# EAGLE schematic LEDdriverSFE_CREE (EAGLE 6.2)
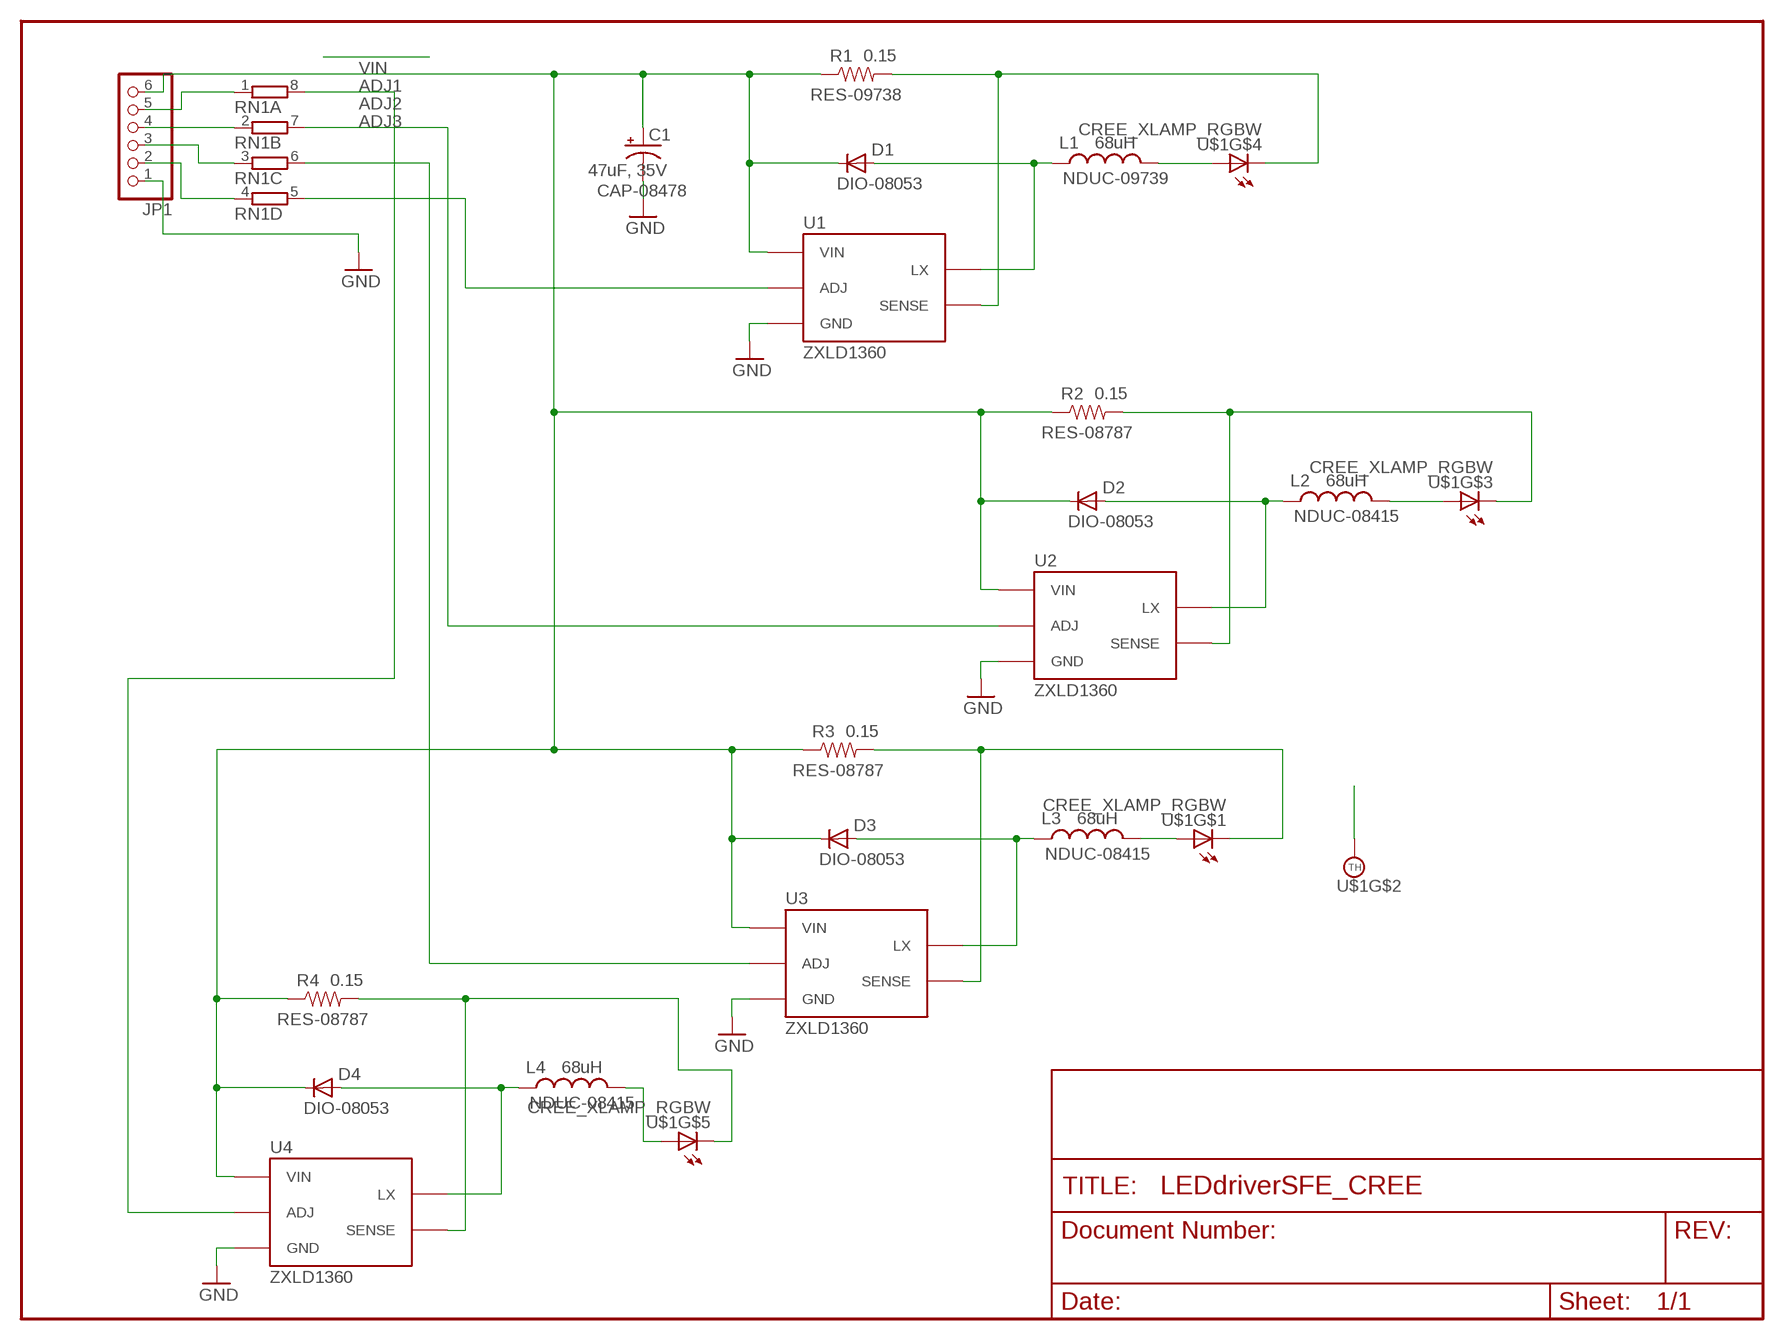
[diagram p0: schematic, sheet 1]

## Parts
C1  47uF, 35V  CAP_POLD  [PANASONIC_D]
D1  MBRA140  DIODESMA  [SMA-DIODE]
D2  MBRA140  DIODESMA  [SMA-DIODE]
D3  MBRA140  DIODESMA  [SMA-DIODE]
D4  MBRA140  DIODESMA  [SMA-DIODE]
JP1  PINHD-1X6  [1X06]
L1  68uH  INDUCTORCR75  [CR75]
L2  68uH  INDUCTORCR75  [CR75]
L3  68uH  INDUCTORCR75  [CR75]
L4  68uH  INDUCTORCR75  [CR75]
R1  0.15  RESISTOR0603-RES  [0603-RES]
R2  0.15  RESISTOR0603-RES  [0603-RES]
R3  0.15  RESISTOR0603-RES  [0603-RES]
R4  0.15  RESISTOR0603-RES  [0603-RES]
RN1  4R-NEXBV8V  [EXBV8V]
U1  ZXLD1360  [SOT23-5]
U2  ZXLD1360  [SOT23-5]
U3  ZXLD1360  [SOT23-5]
U4  ZXLD1360  [SOT23-5]
U$1  CREE_XLAMP_RGBW  [CREE_XLAMP_XML]

## Nets
ADJ1: RN1.5 U1.3(ADJ)
ADJ2: RN1.7 U2.3(ADJ)
ADJ3: RN1.6 U3.3(ADJ)
GND: C1.- JP1.1 U1.2(GND) U2.2(GND) U3.2(GND) U4.2(GND)
N$1: L1.P$2 U$1.3(A)
N$2: D2.A L2.P$1 U2.1(LX)
N$3: R2.2 U2.4(SENSE) U$1.7(C)
N$4: D1.A L1.P$1 U1.1(LX)
N$5: R1.2 U1.4(SENSE) U$1.6(C)
N$6: L2.P$2 U$1.2(A)
N$7: D3.A L3.P$1 U3.1(LX)
N$8: R3.2 U3.4(SENSE) U$1.8(C)
N$9: L3.P$2 U$1.1(A)
N$11: D4.A L4.P$1 U4.1(LX)
N$12: R4.2 U4.4(SENSE) U$1.5(C)
N$13: RN1.8 U4.3(ADJ)
N$14: JP1.2 RN1.4
N$15: JP1.5 RN1.1
N$16: L4.P$2 U$1.4(A)
N$17: JP1.4 RN1.2
N$18: JP1.3 RN1.3
THERM: U$1.P$1(TH)
VIN: C1.+ D1.C D2.C D3.C D4.C JP1.6 R1.1 R2.1 R3.1 R4.1 U1.5(VIN) U2.5(VIN) U3.5(VIN) U4.5(VIN)

## Notes on the sheet
- RES-09738
- DIO-08053
- NDUC-09739
- CAP-08478
- RES-08787
- DIO-08053
- NDUC-08415
- RES-08787
- DIO-08053
- NDUC-08415
- RES-08787
- DIO-08053
- NDUC-08415

## Library data of the parts
C1 = SparkFun:CAP_POL: Capacitor Polarized These are standard SMD and PTH capacitors. Normally 10uF, 47uF, and 100uF in electrolytic and tantalum varieties. Always verify the external diameter of the through hole cap, it varies with capacity, voltage, and manufacturer. The EIA devices should be standard.
D1-D4 = SparkFun:DIODE: Diode These are standard reverse protection diodes and small signal diodes. SMA package can handle up to about 1A. SOD-323 can handle about 200mA. What the SOD-323 package when ordering, there are some mfgs out there that are 5-pin packages.
JP1 = adafruit:PINHD-1X6: PIN HEADER
L1-L4 = SparkFun:INDUCTOR: Inductors Basic Inductor/Choke - 0603 and 1206. Footprints are not proven and vary greatly between part numbers.
R1-R4 = SparkFun:RESISTOR: Resistor Basic schematic elements and footprints for 0603, 1206, and PTH 1/10th watt (small) resistors.
RN1 = resistor-dil:4R-N: Array Chip Resistor Source: RS Component / Phycomp; OC_FARNELL: unknown; OC_NEWARK: unknown
U1-U4 = SparkFun:ZXLD1360: Adjustable constant current switching driver for high-power LEDs
U$1 = led:CREE_XLAMP_RGBW: Cree XLAMP XM-L Color RGBW led http://www.mouser.com/ds/2/90/XLampXML_Color-218132.pdf